# EAGLE design USB_Type-C_Test (EAGLE 7.4.0)
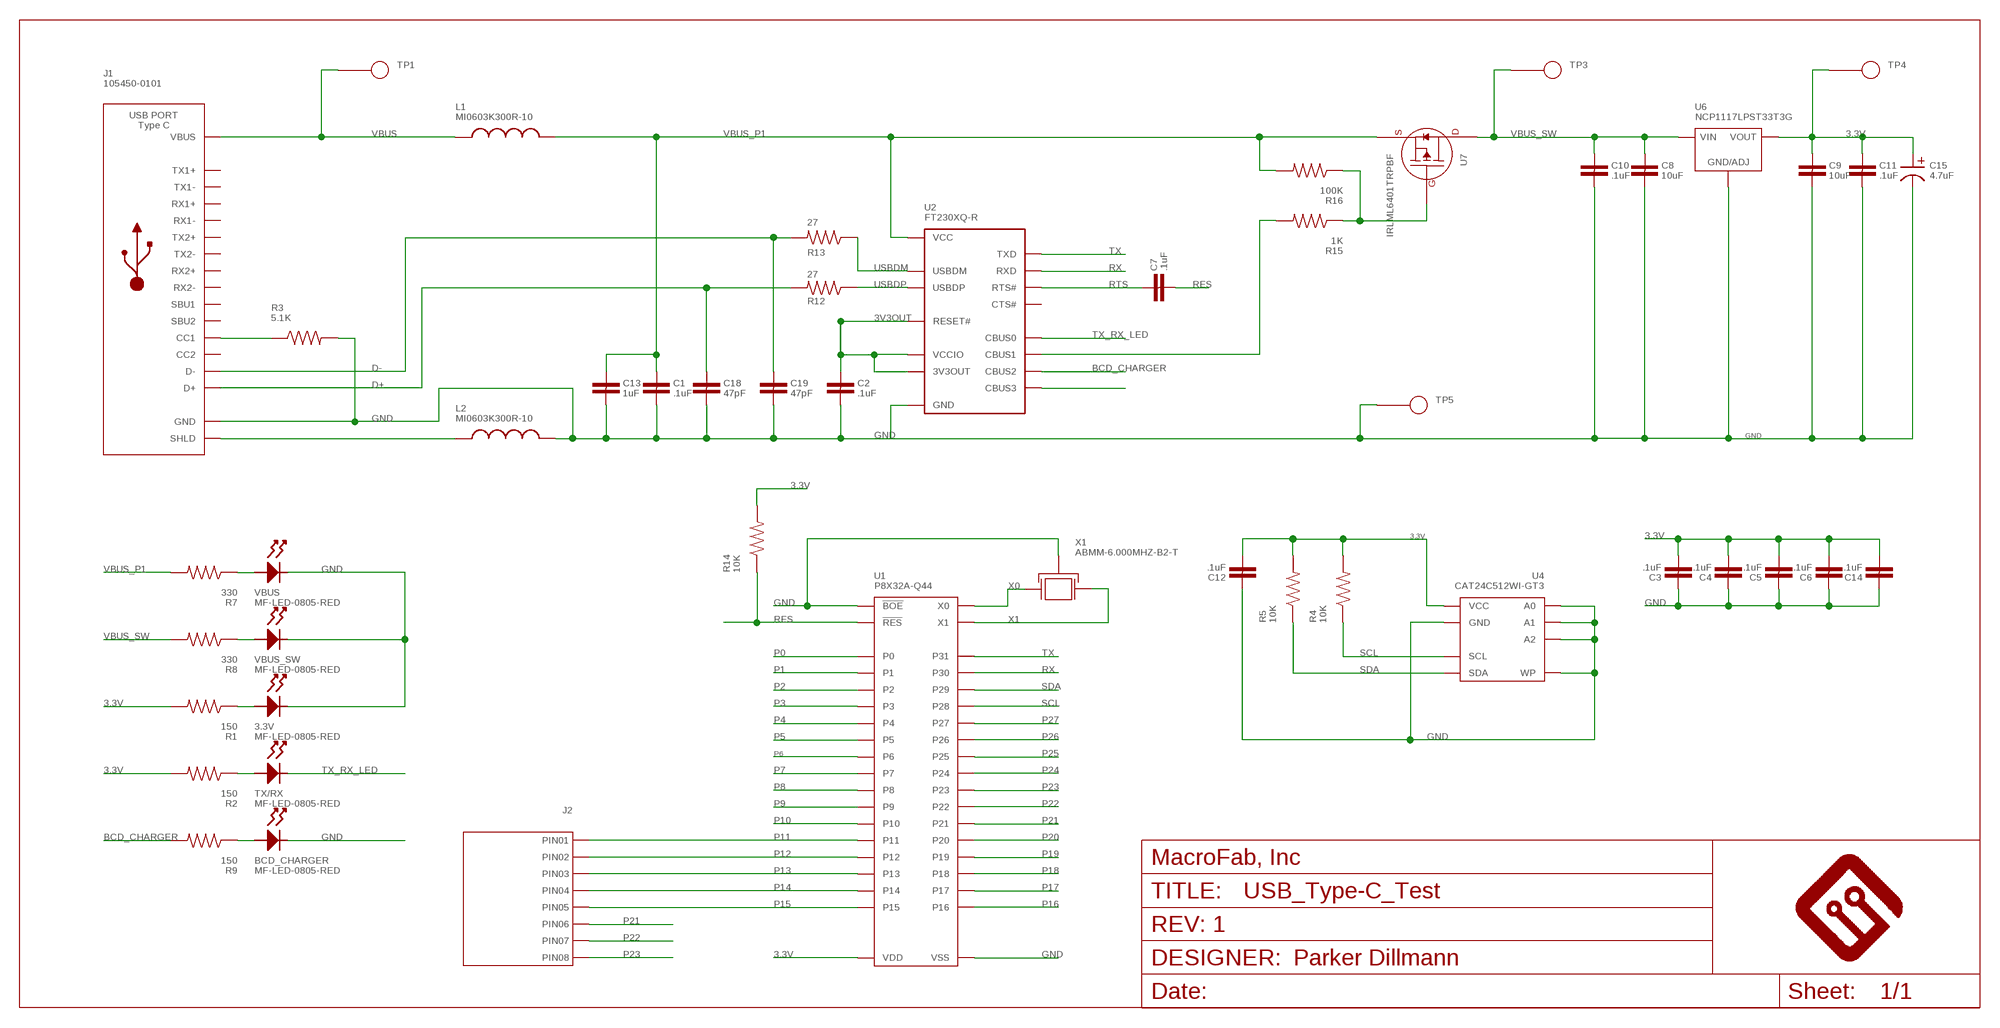
[diagram p0: schematic, sheet 1]

## Parts
3.3V  MF-LED-0805-RED  LED_SINGLE_0805  [LED_0805]
BCD_CHARGER  MF-LED-0805-RED  LED_SINGLE_0805  [LED_0805]
C1  .1uF  CAPACITOR_NON_POLAR_0603  [0603]
C2  .1uF  CAPACITOR_NON_POLAR_0603  [0603]
C3  .1uF  CAPACITOR_NON_POLAR_0603  [0603]
C4  .1uF  CAPACITOR_NON_POLAR_0603  [0603]
C5  .1uF  CAPACITOR_NON_POLAR_0603  [0603]
C6  .1uF  CAPACITOR_NON_POLAR_0603  [0603]
C7  .1uF  CAPACITOR_NON_POLAR_0603  [0603]
C8  10uF  CAPACITOR_NON_POLAR_1206  [1206]
C9  10uF  CAPACITOR_NON_POLAR_1206  [1206]
C10  .1uF  CAPACITOR_NON_POLAR_0603  [0603]
C11  .1uF  CAPACITOR_NON_POLAR_0603  [0603]
C12  .1uF  CAPACITOR_NON_POLAR_0603  [0603]
C13  1uF  CAPACITOR_NON_POLAR_0603  [0603]
C14  .1uF  CAPACITOR_NON_POLAR_0603  [0603]
C15  4.7uF  CAPACITOR_POLARIZED_5MM_SMD  [5MM_CAP_SMD]
C18  47pF  CAPACITOR_NON_POLAR_0603  [0603]
C19  47pF  CAPACITOR_NON_POLAR_0603  [0603]
FRAME1  MF_FRAMEDEFAULT  [MF_FRAME_DEFAULT]
J1  105450-0101  USB_TYPE-C_105450-0101  [105450-0101]
J2  CON_01X08_2.54MM_PIN_HEADER  [2.54MM_01X08_PIN_HEADER]
L1  MI0603K300R-10  INDUCTOR_0603  [0603]
L2  MI0603K300R-10  INDUCTOR_0603  [0603]
R1  150  RESISTOR_0603  [0603]
R2  150  RESISTOR_0603  [0603]
R3  5.1K  RESISTOR_0603  [0603]
R4  10K  RESISTOR_0603  [0603]
R5  10K  RESISTOR_0603  [0603]
R7  330  RESISTOR_0603  [0603]
R8  330  RESISTOR_0603  [0603]
R9  150  RESISTOR_0603  [0603]
R12  27  RESISTOR_0603  [0603]
R13  27  RESISTOR_0603  [0603]
R14  10K  RESISTOR_0603  [0603]
R15  1K  RESISTOR_0603  [0603]
R16  100K  RESISTOR_0603  [0603]
TP1  TEST_POINT_SINGLE_KEYSTONE_5115-5119  [KEYSTONE_5115-5119]
TP3  TEST_POINT_SINGLE_KEYSTONE_5115-5119  [KEYSTONE_5115-5119]
TP4  TEST_POINT_SINGLE_KEYSTONE_5115-5119  [KEYSTONE_5115-5119]
TP5  TEST_POINT_SINGLE_KEYSTONE_5115-5119  [KEYSTONE_5115-5119]
TX/RX  MF-LED-0805-RED  LED_SINGLE_0805  [LED_0805]
U1  P8X32A-Q44  [P8X32A_LQFP-44]
U2  FT230XQ-R  FT230XQ  [FT230X_QFN-16]
U4  CAT24C512WI-GT3  EEPROM_I2CSOIC-8_W  [SOIC-8_W]
U6  NCP1117LPST33T3G  [SOT-223-3]
U7  IRLML6401TRPBF  MOSFET_P-CHANNEL_SINGLE_SOT-23  [SOT-23-3]
VBUS  MF-LED-0805-RED  LED_SINGLE_0805  [LED_0805]
VBUS_SW  MF-LED-0805-RED  LED_SINGLE_0805  [LED_0805]
X1  ABMM-6.000MHZ-B2-T  CYRSTAL_GND_ABMM  [7MMX5MM]

## Nets
3.3V: C3.2 C4.2 C5.2 C6.2 C9.1 C11.1 C12.2 C14.2 C15.P(POS) R1.2 R2.2 R4.2 R5.2 R14.2 TP4.P$1 U1.8(VDD) U1.18(VDD) U1.30(VDD) U1.40(VDD) U4.8(VCC) U6.P$1(VOUT) U6.P$3(VOUT)
3V3OUT: C2.1 U2.1(VCCIO) U2.8(3V3OUT) U2.9(RESET#)
BCD_CHARGER: R9.2 U2.5(CBUS2)
D+: C18.1 J1.A6(D+) J1.B6(D+) R12.2
D-: C19.1 J1.A7(D-) J1.B7(D-) R13.2
GND: 3.3V.CATHODE BCD_CHARGER.CATHODE C1.2 C2.2 C3.1 C4.1 C5.1 C6.1 C8.2 C9.2 C10.2 C11.2 C12.1 C13.2 C14.1 C15.N(NEG) C18.2 C19.2 J1.A1(GND) J1.A12(GND) J1.B1(GND) J1.B12(GND) L2.2 R3.2 TP5.P$1 U1.5(VSS) U1.6(!BOE) U1.17(VSS) U1.27(VSS) U1.39(VSS) U2.3(GND) U2.13(GND) U2.PAD(GND) U4.1(A0) U4.2(A1) U4.3(A2) U4.4(GND) U4.7(WP) U6.P$2(GND/ADJ) VBUS.CATHODE VBUS_SW.CATHODE X1.P$2(GND) X1.P$4(GND)
N$1: 3.3V.ANODE R1.1
N$2: R2.1 TX/RX.ANODE
N$3: BCD_CHARGER.ANODE R9.1
N$4: J1.S_T1(SHLD) J1.S_T2(SHLD) J1.S_T3(SHLD) J1.S_T4(SHLD) L2.1
N$6: J1.A5(CC1) R3.1
N$8: R8.1 VBUS_SW.ANODE
N$9: R7.1 VBUS.ANODE
N$10: U2.14(CBUS3)
N$41: R15.1 R16.1 U7.1(GATE)
P0: U1.41(P0)
P1: U1.42(P1)
P2: U1.43(P2)
P3: U1.44(P3)
P4: U1.1(P4)
P5: U1.2(P5)
P6: U1.3(P6)
P7: U1.4(P7)
P8: U1.9(P8)
P9: U1.10(P9)
P10: U1.11(P10)
P11: J2.1 U1.12(P11)
P12: J2.2 U1.13(P12)
P13: J2.3 U1.14(P13)
P14: J2.4 U1.15(P14)
P15: J2.5 U1.16(P15)
P16: U1.19(P16)
P17: U1.20(P17)
P18: U1.21(P18)
P19: U1.22(P19)
P20: U1.23(P20)
P21: J2.6 U1.24(P21)
P22: J2.7 U1.25(P22)
P23: J2.8 U1.26(P23)
P24: U1.31(P24)
P25: U1.32(P25)
P26: U1.33(P26)
P27: U1.34(P27)
PWREN: R15.2 U2.11(CBUS1)
RES: C7.2 R14.1 U1.7(!RES)
RTS: C7.1 U2.16(RTS#)
RX: U1.37(P30) U2.2(RXD)
SCL: R4.1 U1.35(P28) U4.6(SCL)
SDA: R5.1 U1.36(P29) U4.5(SDA)
TX: U1.38(P31) U2.15(TXD)
TX_RX_LED: TX/RX.CATHODE U2.12(CBUS0)
USBDM: R13.1 U2.7(USBDM)
USBDP: R12.1 U2.6(USBDP)
VBUS: J1.A4(VBUS) J1.A9(VBUS) J1.B4(VBUS) J1.B9(VBUS) L1.1 TP1.P$1
VBUS_P1: C1.1 C13.1 L1.2 R7.2 R16.2 U2.10(VCC) U7.2(SOURCE)
VBUS_SW: C8.1 C10.1 R8.2 TP3.P$1 U6.P$4(VIN) U7.3(DRAIN)
X0: U1.29(X0) X1.P$3(X1)
X1: U1.28(X1) X1.P$1(X0)
Unconnected: J1.A2(TX1+) J1.A3(TX1-) J1.A8(SBU1) J1.A10(RX2-) J1.A11(RX2+) J1.B2(TX2+) J1.B3(TX2-) J1.B5(CC2) J1.B8(SBU2) J1.B10(RX1-) J1.B11(RX1+) U2.4(CTS#)

## Library data of the parts
3.3V BCD_CHARGER TX/RX VBUS VBUS_SW = PP_LED:LED_SINGLE
C1-C14 C18 C19 = PP_Passives:CAPACITOR_NON_POLAR: Capacitor Non Polarized
C15 = PP_Passives:CAPACITOR_POLARIZED: Polarized capacitors
FRAME1 = MF_Aesthetics:MF_FRAME: Library: MF_Aesthetics Description: Frame for adding Meta Data to the PCB and Schematic.; DNAME: Parker Dillmann; HOUSEPART: 0; POPULATE: 0; REVNUM: REV: 1
J1 = PP_Connectors:USB_TYPE-C; MPN: 105450-0101; POPULATE: 1
J2 = PP_Connectors:CON_01X08; POPULATE: 1
L1 L2 = PP_Passives:INDUCTOR: Inductors
R1-R5 R7-R9 R12-R16 = PP_Passives:RESISTOR: Resistors
TP1 TP3-TP5 = PP_Connectors:TEST_POINT_SINGLE; POPULATE: 1
U1 = PP_DigitalIC:P8X32A: Manufacturer Part #: P8X32A Manufacturer: Parallax Description: 32-bit Microcontrollers - MCU Propeller Chip
U2 = PP_DigitalIC:FT230X: Manufacturer Part #: FT230X Manufacturer: FTDI Description: USB Interface IC USB to Basic Serial UART IC
U4 = PP_DigitalIC:EEPROM_I2C
U6 = MF_IC_Power:NCP1117LP: Manufacturer Part #: NCP1117LP Manufacturer: ON Semiconductor Description: LDO Voltage Regulators; HOUSEPART: NO; MPN: NCP1117LPST33T3G; POPULATE: 1; URL: http://www.onsemi.com/pub_link/Collateral/NCP1117LP-D.PDF
U7 = PP_DiscreteSemi:MOSFET_P-CHANNEL_SINGLE
X1 = MF_Frequency_Control:CYRSTAL_GND: Library: MF_Frequency_Control Description: Device for two functional pin Cyrstal Oscillators and a ground.; HOUSEPART: NO; POPULATE: 1; URL: http://www.abracon.com/Resonators/ABMM.pdf

## Board
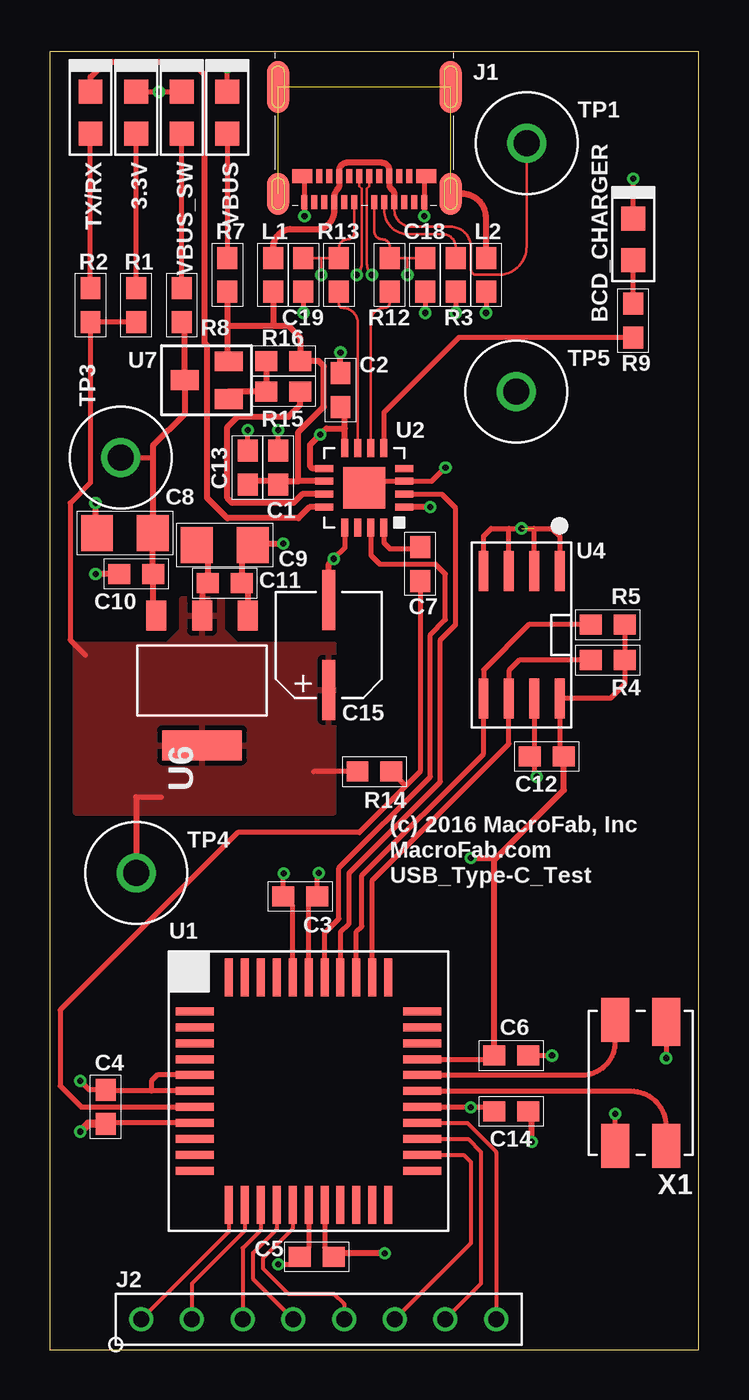
[diagram p1: board, top side]
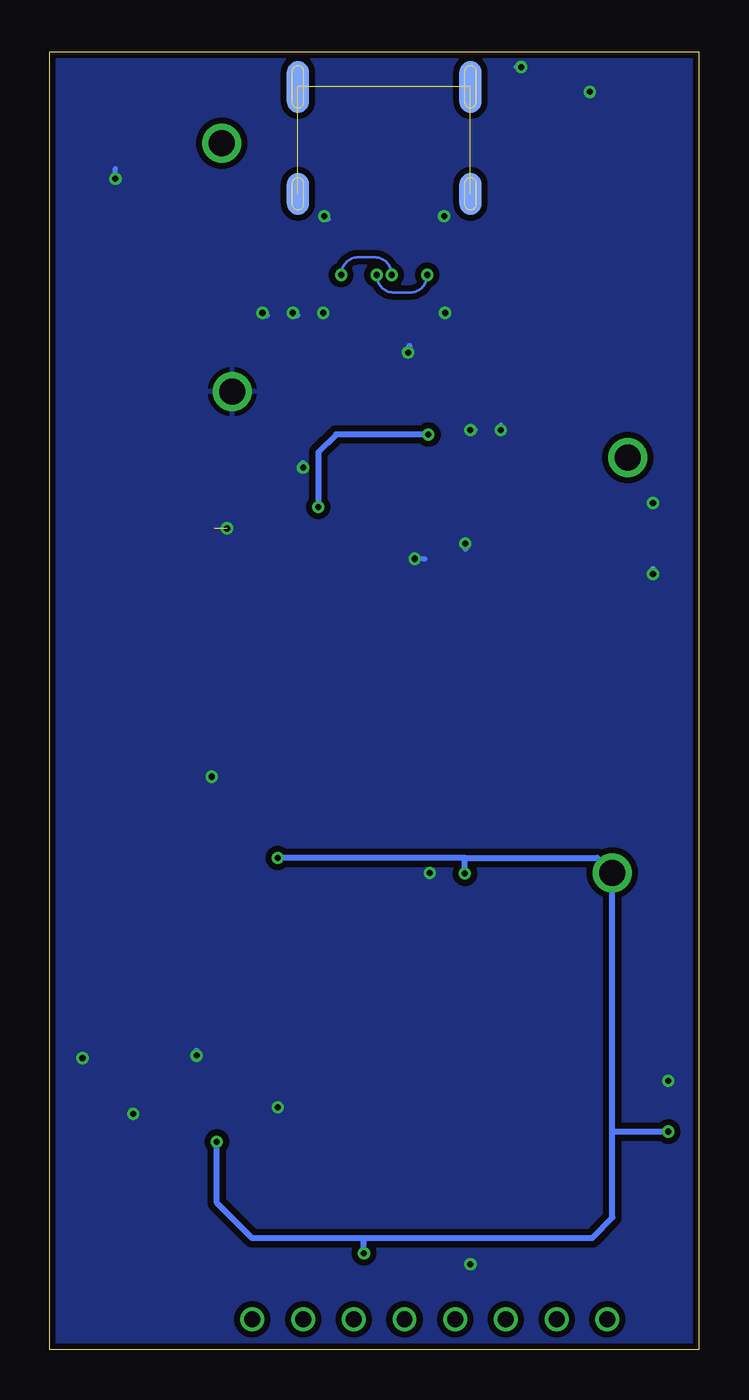
[diagram p2: board, bottom side, seen from below]

Size 32.49 x 65.02 mm. Coordinates in mm from the lower left corner, seen from the top.
Outline: 0,0 32.49,0 32.49,65.02 0,65.02 0,0
Copper layers (1*16): Top 0.035mm / dielectric 1.5mm / Bottom 0.035mm
Design rules "MF_Standard_2_Layer": minimum track width 5mil, minimum drill 12mil, track to track 5mil, track to pad 5mil, pad to pad 5mil, via to via 5mil, smd to smd 0mil, copper to edge 10mil, drill to drill 10mil, minimum pad ring 6mil, minimum via ring 6mil, stop-mask expansion 2mil, vias tented up to drill 25mil, thermal gap 10mil

### Footprints (pad centres in the part's own frame; a part is rotated, then mirrored left to right if it is on the bottom)
LED_0805 = smd 1.2 x 1.2: ANODE 1.05,0; CATHODE -1.05,0
0603 = smd 1.1 x 1: 1 -0.85,0; 2 0.85,0
1206 = smd 1.6 x 1.8: 1 -1.4,0; 2 1.4,0
5MM_CAP_SMD = smd 0.65 x 3: N 0,-2.25; P 0,2.25
105450-0101 = smd 0.3 x 0.7: A1 -3,0.41; A2 -2.5,0.41; A3 -2,0.41; A4 -1.5,0.41; A5 -1,0.41; A6 -0.5,0.41; A7 0.5,0.41; A8 1,0.41; A9 1.5,0.41; A10 2,0.41; A11 2.5,0.41; A12 3,0.41; B2 2.25,-0.89; B3 1.75,-0.89; B4 1.25,-0.89; B5 0.75,-0.89; B6 0.25,-0.89; B7 -0.25,-0.89; B8 -0.75,-0.89; B9 -1.25,-0.89; B10 -1.75,-0.89; B11 -2.25,-0.89 | smd 1 x 0.7: B1 3.1,-0.89; B12 -3.1,-0.89 | smd 1.1 x 2.6 bottom: S_B1 -4.32,-5.36; S_B4 4.32,-5.36 | smd 1.1 x 2.1 bottom: S_B2 -4.32,0; S_B3 4.32,0 | smd 1.1 x 2.6: S_T1 -4.32,-5.36; S_T4 4.32,-5.36 | smd 1.1 x 2.1: S_T2 -4.32,0; S_T3 4.32,0
2.54MM_01X08_PIN_HEADER = drill 0.8: 1 -8.89,0; 2 -6.35,0; 3 -3.81,0; 4 -1.27,0; 5 1.27,0; 6 3.81,0; 7 6.35,0; 8 8.89,0
KEYSTONE_5115-5119 = drill 1.3: P$1 0,0
P8X32A_LQFP-44 = smd 1.9 x 0.4: 1 -5.7,4; 2 -5.7,3.2; 3 -5.7,2.4; 4 -5.7,1.6; 5 -5.7,0.8; 6 -5.7,0; 7 -5.7,-0.8; 8 -5.7,-1.6; 9 -5.7,-2.4; 10 -5.7,-3.2; 11 -5.7,-4; 23 5.7,-4; 24 5.7,-3.2; 25 5.7,-2.4; 26 5.7,-1.6; 27 5.7,-0.8; 28 5.7,0; 29 5.7,0.8; 30 5.7,1.6; 31 5.7,2.4; 32 5.7,3.2; 33 5.7,4 | smd 0.4 x 1.9: 12 -4,-5.7; 13 -3.2,-5.7; 14 -2.4,-5.7; 15 -1.6,-5.7; 16 -0.8,-5.7; 17 0,-5.7; 18 0.8,-5.7; 19 1.6,-5.7; 20 2.4,-5.7; 21 3.2,-5.7; 22 4,-5.7; 34 4,5.7; 35 3.2,5.7; 36 2.4,5.7; 37 1.6,5.7; 38 0.8,5.7; 39 0,5.7; 40 -0.8,5.7; 41 -1.6,5.7; 42 -2.4,5.7; 43 -3.2,5.7; 44 -4,5.7
FT230X_QFN-16 = smd 0.9 x 0.35: 1 -2,0.975; 2 -2,0.325; 3 -2,-0.325; 4 -2,-0.975; 9 2,-0.975; 10 2,-0.325; 11 2,0.325; 12 2,0.975 | smd 0.35 x 0.9: 5 -0.975,-2; 6 -0.325,-2; 7 0.325,-2; 8 0.975,-2; 13 0.975,2; 14 0.325,2; 15 -0.325,2; 16 -0.975,2 | smd 2.1 x 2.1: PAD 0,0
SOIC-8_W = smd 2 x 0.5: 1 -3.185,1.905; 2 -3.185,0.635; 3 -3.185,-0.635; 4 -3.185,-1.905; 5 3.185,-1.905; 6 3.185,-0.635; 7 3.185,0.635; 8 3.185,1.905
SOT-223-3 = smd 1.5 x 4: P$1 3.25,0 | smd 1.5 x 1: P$2 -3.25,2.3; P$3 -3.25,0; P$4 -3.25,-2.3
SOT-23-3 = smd 1 x 1.4: 1 -0.95,-1.1; 2 0.95,-1.1; 3 0,1.1
7MMX5MM = smd 1.4 x 2.2: P$1 -1.27,3.15; P$2 1.27,3.15; P$3 1.27,-3.15 | smd 1.4 x 2.4: P$4 -1.27,-3.05

### Placement (x,y rotation side)
3.3V  4.32,61.98 270 top
BCD_CHARGER  29.21,55.63 270 top
C1  11.43,44.2 90 top
C2  14.55,48.08 90 top
C3  12.55,22.71 180 top
C4  2.79,12.17 270 top
C5  13.36,4.65 0 top
C6  23.11,14.73 180 top
C7  18.54,39.37 270 top
C8  3.76,40.92 180 top
C9  8.76,40.31 0 top
C10  4.32,38.86 180 top
C11  8.76,38.4 0 top
C12  24.89,29.72 0 top
C13  9.91,44.2 90 top
C14  23.11,11.94 0 top
C15  13.97,35.31 180 top
C18  18.8,53.85 270 top
C19  12.7,53.85 270 top
FRAME1  17.02,27.18 0 top
J1  15.75,57.91 180 top
J2  13.46,1.52 0 top
L1  11.18,53.85 270 top
L2  21.84,53.85 270 top
R1  4.32,52.32 270 top
R2  2.03,52.32 270 top
R3  20.32,53.85 270 top
R4  27.94,34.54 0 top
R5  27.94,36.32 0 top
R7  8.89,53.85 270 top
R8  6.6,52.32 270 top
R9  29.21,51.56 270 top
R12  17.02,53.85 90 top
R13  14.48,53.85 90 top
R14  16.26,28.96 180 top
R15  11.68,48.01 0 top
R16  11.68,49.53 0 top
TP1  23.88,60.45 0 top
TP3  3.56,44.7 90 top
TP4  4.32,23.88 0 top
TP5  23.37,48.01 0 top
TX/RX  2.03,61.98 270 top
U1  12.95,12.95 0 top
U2  15.75,43.18 180 top
U4  23.62,35.81 270 top
U6  7.62,33.53 270 top
U7  7.85,48.56 90 top
VBUS  8.89,61.98 270 top
VBUS_SW  6.6,61.98 270 top
X1  29.59,13.36 180 top

### Tracks (layer width: path | path; a pad name or v marks a point on that pad's centre or on a via)
3.3V  (via drill 0.3)
  Top 0.254: U1.30 22.09,14.55 | U1.40 12.15,22.25 C3.2 11.7,23.85 v11.71,23.85 | C12.2 25.53,29.72 U4.8 28.08,32.63 28.79,33.34 R4.2 R5.2 | U1.8 2.83,11.35 C4.2 | R14.2 13.21,28.96 | 4.32,27.69 5.59,27.69 | R1.2 R2.2 2.03,43.43 1.02,42.42 1.02,35.56 1.78,34.8 | U1.18 13.75,5.11 C5.2
  Top 0.305: C9.1 7.91,39.76 C11.1 7.62,38.11 U6.P$3 | 4.32,27.69 TP4.P$1 | v21.08,24.64 22.35,24.64 | 22.35,24.64 25.74,28.03 C12.2 | C6.2 22.26,24.55 22.35,24.64 | v24.13,10.41 24.13,11.77 | v16.76,4.83 14.39,4.83
  Top 0.406: 22.09,14.55 C6.2 | C4.2 1.92,11.32 v1.52,10.92 | 24.13,11.77 C14.2 | 14.39,4.83 C5.2
  Bottom 0.305: v11.71,23.85 11.71,24.64 | 11.71,24.64 v21.08,24.64 | 11.71,24.64 5.08,24.64 TP4.P$1 4.32,10.92 | 4.32,10.92 4.32,6.6 5.33,5.59 16.76,5.59 | v24.13,10.41 24.13,7.37 22.35,5.59 16.76,5.59 | v1.52,10.92 4.32,10.92 | v16.76,4.83 16.76,5.59
  pour Top: 6.6,37.59 6.6,36.02 5.89,35.31 1.27,35.31 1.27,26.92 14.22,26.92 14.22,35.31 9.35,35.31 8.64,36.02 8.64,37.59
3V3OUT  (via drill 0.3 pad 0.46)
  Top 0.305: U2.8 14.77,46.15 | 14.77,46.15 14.77,47.01 C2.1 | U2.9 13.15,44.16 13.03,44.27 13.03,45.34 v13.54,45.85 13.84,46.15 14.77,46.15 | v19.05,42.22 17.76,42.22 U2.1
  Bottom 0.305: v13.54,45.85 18.16,45.85 19.05,44.96 v19.05,42.22
BCD_CHARGER
  Top 0.254: R9.2 20.49,50.71 16.72,46.95 U2.5
D+  (via drill 0.3)
  Top 0.127: J1.B6 15.5,58.29 15.62,58.17 15.62,54.46 arc-45 v15.37,53.85 | J1.A6 16.25,56.04 arc90 16.66,55.63 arc-90 17.02,55.27 R12.2 17.91,54.7 | C18.1 17.91,54.7 | v17.91,53.85 17.91,54.7
  Bottom 0.127: v15.37,53.85 arc-90 16.26,54.74 17.02,54.74 arc-90 v17.91,53.85
D-  (via drill 0.3)
  Top 0.127: J1.B7 16,58.29 15.88,58.17 15.88,54.46 arc45 v16.13,53.85 | J1.A7 15.25,55.99 arc-90 14.88,55.63 arc90 14.48,55.22 R13.2 13.59,54.7 | 13.59,54.7 C19.1 | v13.59,53.85 13.59,54.7
  Bottom 0.127: v16.13,53.85 arc-90 15.24,52.96 14.48,52.96 arc-90 v13.59,53.85
GND  (via drill 0.3, 0.3 pad 0.46)  (1 unrouted)
  Top 0.254: J1.B12 18.75,58.7 J1.A1 v18.75,56.79 | J1.B1 12.75,58.7 J1.A12 v12.75,56.79 | C19.2 v12.7,51.94 | C18.2 v18.8,51.94 | R3.2 v20.32,51.94 | L2.2 v21.84,51.94 | C1.2 v11.43,46.08 | C13.2 v9.91,46.08 | U2.13 14.77,40.17 v14.22,39.62 | v19.81,44.2 19.12,43.51 U2.3 16.07,43.51 U2.PAD | 3.3V.CATHODE VBUS_SW.CATHODE v5.47,63.03 v5.46,63.02 | VBUS.CATHODE v8.89,64.26 | U1.27 22.26,12.15 | C6.1 v25.15,14.73 | 22.06,12.14 v21.08,12.14 | U1.39 12.95,22.26 C3.1 13.4,23.81 v13.46,23.88 | U4.7 24.26,29.72 | 24.26,29.72 C12.1 | U4.4 21.72,40.77 22.1,41.15 22.99,41.15 | 22.99,41.15 24.26,41.15 | 24.26,41.15 25.15,41.15 25.53,40.77 U4.1 | U4.2 24.26,41.15 | U4.3 22.99,41.15 | 24.26,29.72 24.26,28.83 v24.38,28.7 | U1.6 5.08,12.95 | 5.08,12.95 2.86,12.95 C4.1 1.97,13.02 v1.52,13.46 | U1.5 5.37,13.75 5.08,13.46 5.08,12.95 | U1.17 12.95,5.09 C5.1 12.13,4.27 v11.43,4.27 | BCD_CHARGER.CATHODE v29.21,58.67 | X1.P$4 v30.86,14.61 | X1.P$2 v28.32,11.81
  Top 0.305: C2.2 v14.55,49.96 | C10.2 v2.29,38.86 | C8.2 2.29,40.99 v2.29,42.42 | U6.P$2 9.92,38.1 C11.2 9.61,39.76 C9.2 10.24,40.39 v11.68,40.39 | C15.N 13.97,39.37 v14.22,39.62 | 22.26,12.15 C14.1 22.06,12.14
  Bottom 0.254: v12.75,56.79 12.55,56.79 | v18.75,56.79 18.75,56.64 18.54,56.64 | v12.7,51.94 12.7,51.82 | v18.8,51.94 18.8,51.82 | v20.32,51.94 20.32,51.82 20.07,51.82 | v21.84,51.94 21.72,51.82 21.59,51.82 | v11.43,46.08 11.18,46.08 | v9.91,46.08 9.91,46.33 | v14.22,39.62 13.72,39.62 | v19.81,44.2 19.81,44.45 | v8.89,64.26 9.14,64.26 | v29.21,58.67 29.21,59.18
  Bottom 0.305: v14.55,49.96 14.48,50.04 14.48,50.29 | v2.29,38.86 2.29,39.12 | v11.68,40.39 11.68,40.13 | v25.15,14.73 25.15,14.99
  other vias: 23.62,41.15
  pour Bottom (isolate 0.305, rank 6): 0,65.02 32.51,65.02 32.51,0 0,0
N$1
  Top 0.254: R1.1 3.3V.ANODE
N$2
  Top 0.254: R2.1 TX/RX.ANODE
N$3
  Top 0.254: R9.1 BCD_CHARGER.ANODE
N$4  (3 unrouted)
  Top 0.305: L2.1 21.84,56.71 arc90 20.64,57.91 J1.S_T2
N$6
  Top 0.127: J1.A5 16.75,57.09 arc90 17.96,55.88 19.68,55.88 arc-90 20.32,55.24 R3.1
N$8
  Top 0.254: R8.1 VBUS_SW.ANODE
N$9
  Top 0.254: VBUS.ANODE R7.1
N$41
  Top 0.305: R16.1 R15.1 8.95,48.01 U7.1
P11
  Top 0.203: U1.12 8.95,5.91 J2.1
P12
  Top 0.203: U1.13 9.75,5.94 7.11,3.3 J2.2
P13
  Top 0.203: U1.14 10.55,5.98 9.65,5.08 J2.3
P14
  Top 0.203: U1.15 11.35,6.02 10.16,4.83 10.16,3.56 J2.4
P15
  Top 0.203: U1.16 12.15,6.06 10.67,4.57 10.67,4.06 11.94,2.79 14.22,2.79 14.73,2.29 J2.5
P21
  Top 0.203: U1.24 20.73,9.75 21.08,9.4 21.08,5.33 J2.6
P22
  Top 0.203: U1.25 20.94,10.55 21.59,9.91 21.59,3.3 J2.7
P23
  Top 0.203: U1.26 20.9,11.35 22.35,9.91 J2.8
PWREN
  Top 0.305: U2.11 12.63,42.85 12.19,42.42 9.14,42.42 8.89,42.67 8.89,46.23 9.4,46.74 11.94,46.74 12.53,47.33 R15.2
RES
  Top 0.254: C7.2 18.54,28.96 17.91,28.32 | 17.91,28.32 15.49,25.91 9.4,25.91 0.51,17.02 0.51,13.21 1.56,12.15 U1.7 | R14.1 17.74,28.32 17.91,28.32
RTS
  Top 0.254: U2.16 16.72,40.43 17.02,40.13 18.2,40.13 C7.1
RX
  Top 0.254: U2.2 19.63,42.85 20.32,42.16 20.32,36.32 19.56,35.56 19.56,28.45 14.99,23.88 14.99,21.34 14.55,20.9 U1.37
SCL
  Top 0.254: R4.1 23.51,34.54 22.99,34.02 U4.6 22.99,30.35 16.15,23.52 U1.35
SDA
  Top 0.254: U1.36 15.35,20.94 15.62,21.21 15.62,23.75 21.72,29.84 U4.5 21.72,34.06 23.98,36.32 R5.1
TX
  Top 0.254: U2.15 16.07,39.81 16.51,39.37 19.3,39.37 19.81,38.86 19.81,36.58 19.05,35.81 19.05,28.7 14.48,24.13 14.48,21.59 13.75,20.87 U1.38
TX_RX_LED
  Top 0.305: U2.12 12.99,42.2 12.45,41.66 8.89,41.66 7.87,42.67 7.87,50.29 7.75,50.42 7.75,63.88 7.11,64.52 2.79,64.52 2.03,63.75 TX/RX.CATHODE
USBDM
  Top 0.127: R13.1 14.48,52.38 arc90 14.66,52.2 arc-90 15.42,51.43 U2.7
USBDP
  Top 0.127: R12.1 17.02,52.45 arc-90 16.76,52.2 arc90 16.07,51.51 U2.6
VBUS
  Top 0.127: J1.A4 17.25,57.13 arc90 18.12,56.26 20.06,56.26 arc-90 21.08,55.24 21.08,54.13 arc90 21.37,53.85 22.46,53.85 arc90 23.88,55.27 TP1.P$1
  Top 0.305: J1.A4 17.25,57.91 arc45 17.18,58.09 17.08,58.18 arc-45 17,58.38 J1.B9 17,59.1 arc90 16.63,59.46 14.86,59.46 arc90 14.5,59.1 J1.B4 14.5,58.37 arc-45 14.4,58.14 arc45 14.25,57.77 J1.A9 14.25,57.07 arc-90 13.31,56.13 12.09,56.13 arc90 11.18,55.22 L1.1
VBUS_P1
  Top 0.254: 11.59,43.51 C1.1
  Top 0.305: R7.2 8.89,51.31 | 8.89,51.31 11.18,51.31 | 11.18,51.31 11.94,51.31 12.53,50.71 R16.2 13.46,49.53 13.72,49.28 13.72,47.24 12.45,45.97 12.45,43.51 | 8.89,51.31 8.89,49.57 U7.2 | U2.10 12.45,43.51 | 12.45,43.51 11.59,43.51 10.06,43.51 C13.1 | L1.2 11.18,51.31
VBUS_SW
  Top 0.254: TP3.P$1 5.16,44.7
  Top 0.305: R8.2 6.75,51.33 U7.3 6.75,46.88 5.16,45.29 5.16,44.7 C8.1 5.16,38.87 C10.1 5.17,36.93 U6.P$4
X0
  Top 0.254: U1.29 26.64,13.75 arc90 28.32,15.44 X1.P$3
X1
  Top 0.254: U1.28 29.1,12.95 arc-90 30.86,11.19 X1.P$1